# EAGLE design page1 (EAGLE 6.4)
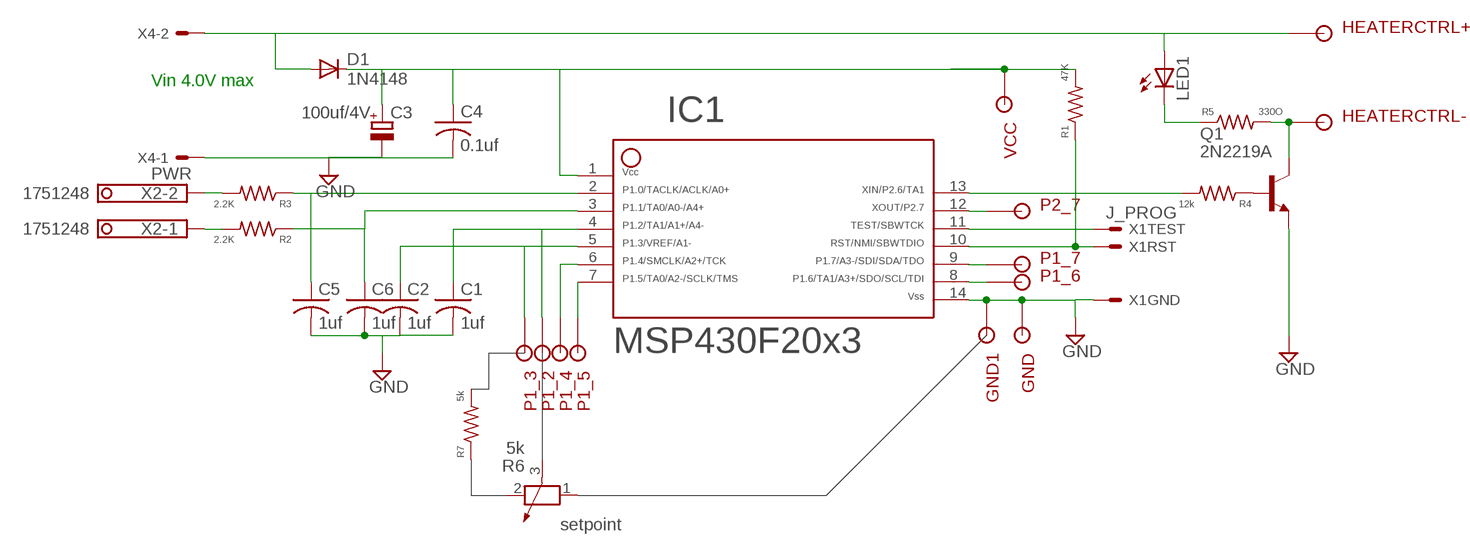
[diagram p0: schematic, sheet 1]

## Parts
C1  1uf  C-USC0805  [C0805]
C2  1uf  C-USC0805  [C0805]
C3  100uf/4V  CPOL-EUSMCB  [SMC_B]
C4  0.1uf  C-USC0805  [C0805]
C5  1uf  C-USC0805  [C0805]
C6  1uf  C-USC0805  [C0805]
D1  1N4148  [DIO-35-10]
GND  SOLDER_POINTA  [P1-13]
GND1  SOLDER_POINTA  [P1-13]
HEATERCTRL+  SOLDER_POINTA  [P1-13]
HEATERCTRL-  SOLDER_POINTA  [P1-13]
IC1  F20X3---N14  [N14]
LED1  LED5MM  [LED5MM]
P1_2  SOLDER_POINTA  [P1-13]
P1_3  SOLDER_POINTA  [P1-13]
P1_4  SOLDER_POINTA  [P1-13]
P1_5  SOLDER_POINTA  [P1-13]
P1_6  SOLDER_POINTA  [P1-13]
P1_7  SOLDER_POINTA  [P1-13]
P2_7  SOLDER_POINTA  [P1-13]
Q1  2N2219A  2N2219ATO92_EBC  [TO92-EBC]
R1  47K  R-US_M0805  [M0805]
R2  2.2K  R-US_M0805  [M0805]
R3  2.2K  R-US_M0805  [M0805]
R4  12k  R-US_M0805  [M0805]
R5  330O  R-US_0207/15  [0207/15]
R6  5k  POTENTIOMETER_PT-10  [PT-10]
R7  5k  R-US_0207/15  [0207/15]
VCC  SOLDER_POINTA  [P1-13]
X1  J_PROG  J_PROG_MSP430  [MOLEX-3PIN]
X2  1751248  [1751248]
X4  PWR  22-23-2021  [22-23-2021]

## Nets
GND: C1.2 C2.2 C3.- C4.2 C5.2 C6.2 GND1.1 GND.1 IC1.14 Q1.E X1.3 X4.1
N$1: IC1.10 R1.1 X1.2
N$2: IC1.11 X1.1
N$3: C3.+ C4.1 D1.P$1(C) IC1.1 R1.2 VCC.1
N$4: R2.2 X2.1
N$5: R3.2 X2.2
N$6: Q1.B R4.1
N$7: C2.1 IC1.5 P1_3.1
N$8: D1.P$2(A) HEATERCTRL+.1 LED1.A X4.2
N$9: C1.1 IC1.4 P1_2.1
N$10: IC1.13 R4.2
N$11: HEATERCTRL-.1 Q1.C R5.2
N$12: LED1.K(C) R5.1
N$13: IC1.6 P1_4.1
N$14: IC1.7 P1_5.1
N$15: C5.1 IC1.2 R3.1
N$16: C6.1 IC1.3 R2.1
N$17: IC1.12 P2_7.1
N$18: IC1.9 P1_7.1
N$19: IC1.8 P1_6.1
Unconnected: R6.1 R6.2 R6.3 R7.1 R7.2

## Notes on the sheet
- Vin 4.0V max
- setpoint

## Library data of the parts
C1 C2 C4-C6 = rcl:C-US: CAPACITOR, American symbol
C3 = rcl:CPOL-EU: POLARIZED CAPACITOR, European symbol
D1 = dedenbear:1N4148
GND GND1 HEATERCTRL+ HEATERCTRL- P1_2-P1_7 P2_7 VCC = Stofer:SOLDER_POINT
IC1 = TI_MSP430_v12:F20X3---N14: ***MSP430F20x3***N14
LED1 = led:LED: LED OSRAM: - CHIPLED LG R971, LG N971, LY N971, LG Q971, LY Q971, LO R971, LY R971 LH N974, LH R974 LS Q976, LO Q976, LY Q976 LO Q996 - Hyper CHIPLED LW Q18S LB Q993, LB Q99A, LB R99A - SideLED LS A670, LO A670, LY A670, LG A670, LP A670 LB A673, LV A673, LT A673, LW A673 LH A674 LY A675 LS A676, LA A676, LO A676, LY A676, LW A676 LS A679, LY A679, LG A679 - Hyper Micro SIDELED® LS Y876, LA Y876, LO Y876, LY Y876 LT Y87S - SmartLED LW L88C, LW L88S LB L89C, LB L89S, LG L890 LS L89K, LO L89K, LY L89K LS L896, LA L896, LO L896, LY L896 - TOPLED LS T670, LO T670, LY T670, LG T670, LP T670 LSG T670, LSP T670, LSY T670, LOP T670, LYG T670 LG T671, LOG T671, LSG T671 LB T673, LV T673, LT T673, LW T673 LH T674 LS T676, LA T676, LO T676, LY T676, LB T676, LH T676, LSB T676, LW T676 LB T67C, LV T67C, LT T67C, LS T67K, LO T67K, LY T67K, LW E67C LS E67B, LA E67B, LO E67B, LY E67B, LB E67C, LV E67C, LT E67C LW T67C LS T679, LY T679, LG T679 LS T770, LO T770, LY T770, LG T770, LP T770 LB T773, LV T773, LT T773, LW T773 LH T774 LS E675, LA E675, LY E675, LS T675 LS T776, LA T776, LO T776, LY T776, LB T776 LHGB T686 LT T68C, LB T68C - Hyper Mini TOPLED® LB M676 - Mini TOPLED Santana® LG M470 LS M47K, LO M47K, LY M47K Source: http://www.osram.convergy.de - LUMILED® LXK2-PW12-R00, LXK2-PW12-S00, LXK2-PW14-U00, LXK2-PW14-V00 LXK2-PM12-R00, LXK2-PM12-S00, LXK2-PM14-U00 LXK2-PE12-Q00, LXK2-PE12-R00, LXK2-PE12-S00, LXK2-PE14-T00, LXK2-PE14-U00 LXK2-PB12-K00, LXK2-PB12-L00, LXK2-PB12-M00, LXK2-PB14-N00, LXK2-PB14-P00, LXK2-PB14-Q00 LXK2-PR12-L00, LXK2-PR12-M00, LXK2-PR14-Q00, LXK2-PR14-R00 LXK2-PD12-Q00, LXK2-PD12-R00, LXK2-PD12-S00 LXK2-PH12-R00, LXK2-PH12-S00 LXK2-PL12-P00, LXK2-PL12-Q00, LXK2-PL12-R00 Source: www.luxeon.com
Q1 = transistor-npn:2N2219A: NPN Transistor
R1-R5 R7 = rcl:R-US_: RESISTOR, American symbol
R6 = rcl:POTENTIOMETER_: Potentiometer
X1 = Stofer:J_PROG_MSP430: .100" (2.54mm) Center Header - 3 Pin
X2 = con-phoenix-350:1751248: MKDS 1/ 2-3,5 Printklemme Nennstrom: 10 A Bemessungsspannung: 160 V Raster: 3,5 mm Polzahl: 2 Montageart: Löten Anschlussart: Schraubanschluss Anschlussrichtung vom Leiter zur Platine: 0° Source: http://eshop.phoenixcontact.com .. 1751248.pdf; OC_FARNELL: unknown; OC_NEWARK: unknown
X4 = con-molex:22-23-2021: .100" (2.54mm) Center Header - 2 Pin

## Board
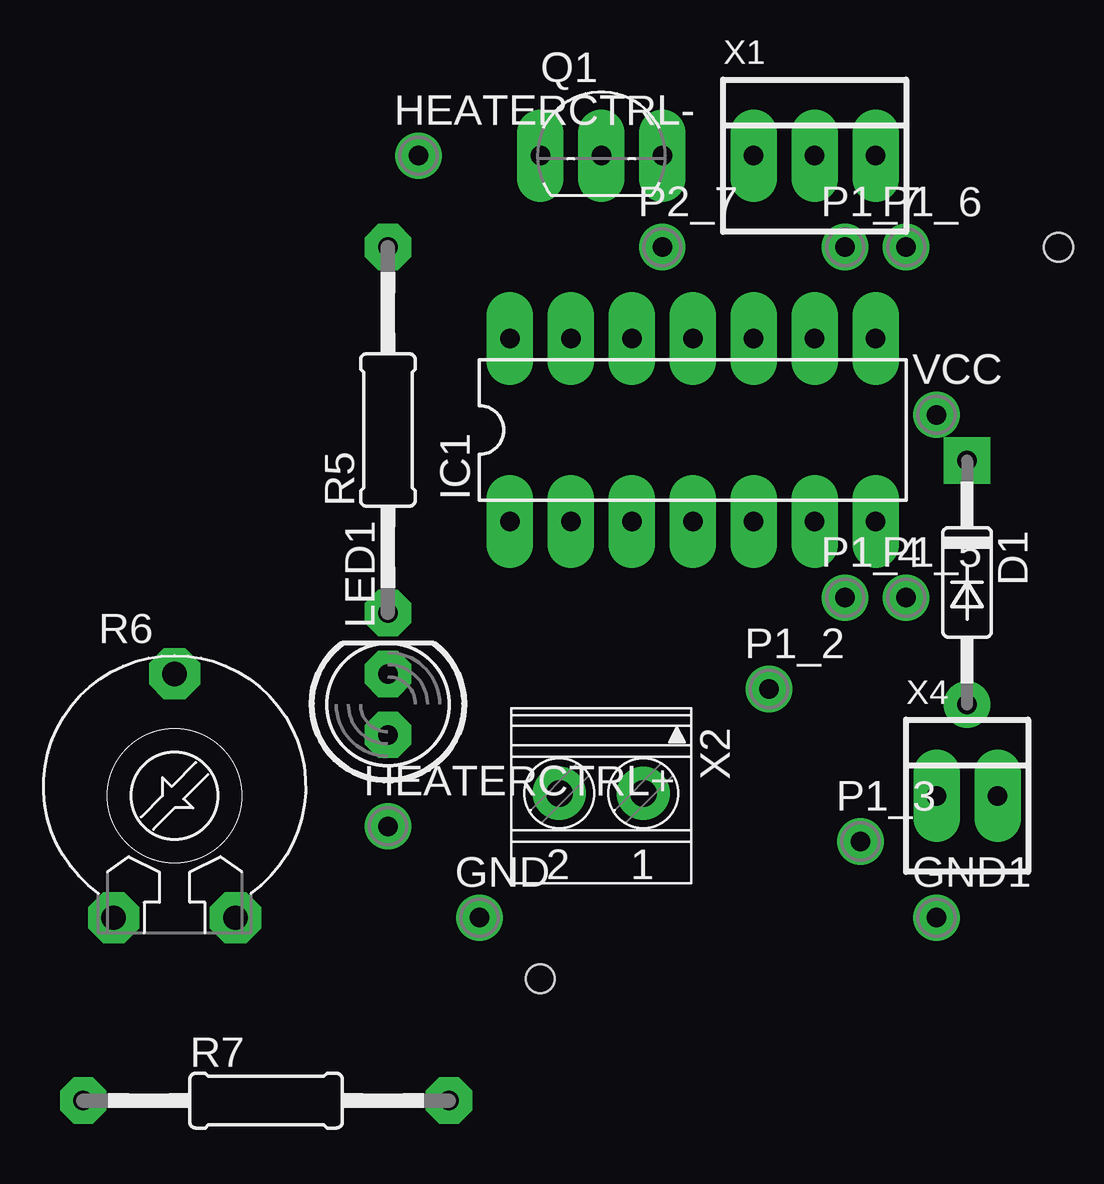
[diagram p1: board, top side]
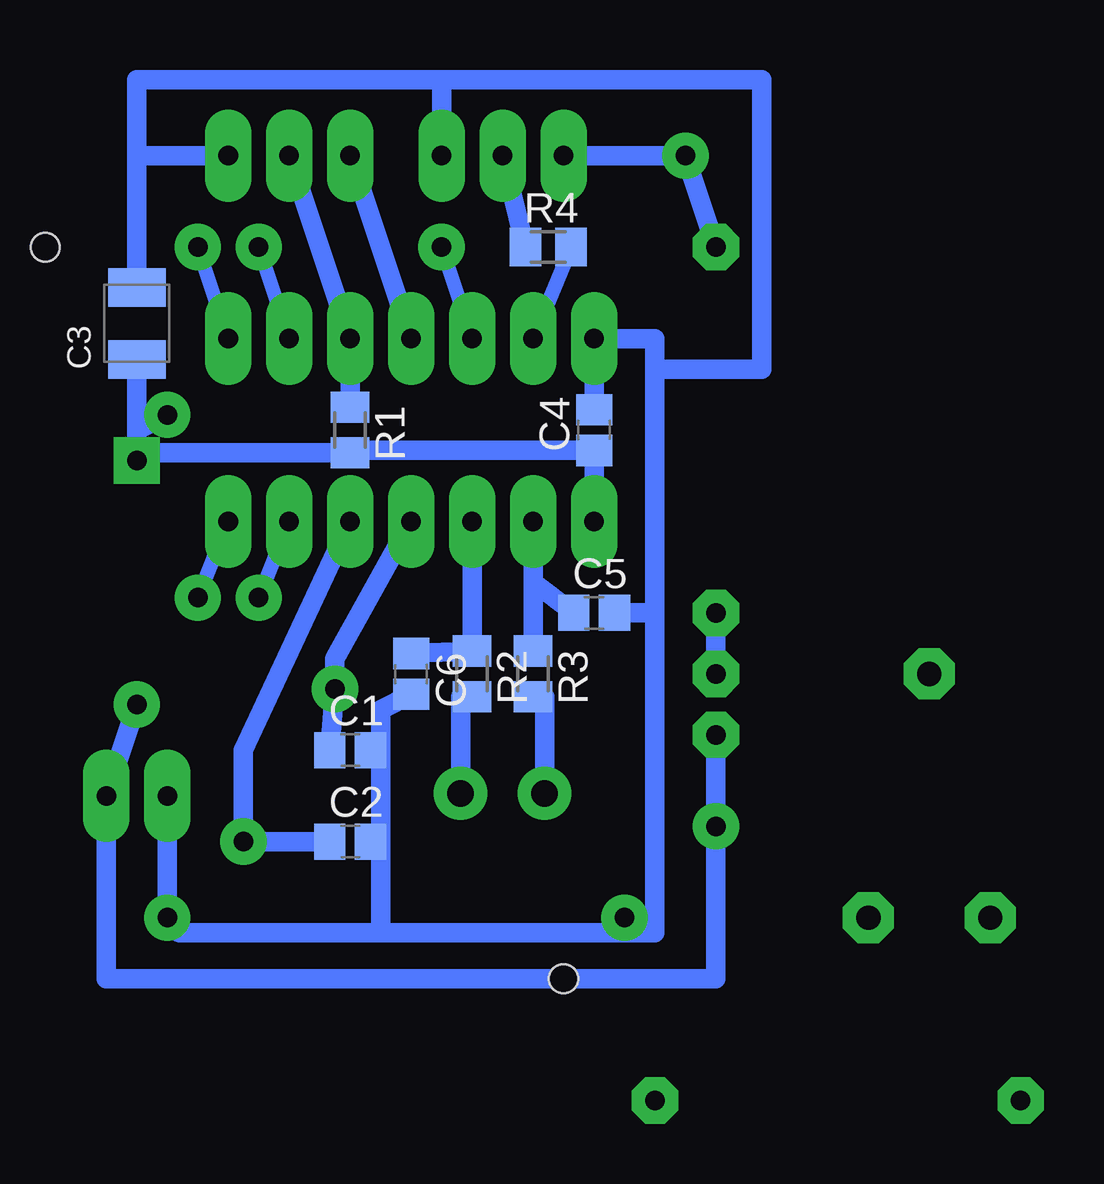
[diagram p2: board, bottom side, seen from below]

No outline drawn. Coordinates in mm, seen from the top.
Copper layers (1*16): Top 0.035mm / dielectric 0.2mm / Bottom 0.035mm
Design rules "default *": minimum track width 10mil, minimum drill 24mil, track to track 8mil, track to pad 8mil, pad to pad 8mil, via to via 8mil, smd to smd 8mil, copper to edge 40mil, drill to drill 8mil, minimum pad ring 15mil, minimum via ring 8mil, stop-mask expansion 4mil, vias tented up to drill 0mil, thermal gap 10mil
Holes 1.2 mm at 34.29,31.75 12.7,1.27

### Footprints (pad centres in the part's own frame; a part is rotated, then mirrored left to right if it is on the bottom)
C0805 = smd 1.3 x 1.5: 1 -0.85,0; 2 0.85,0
SMC_B = smd 1.6 x 2.4: + -1.5,0; - 1.5,0
DIO-35-10 = drill 0.813 square: P$1 -5.08,0 | drill 0.813: P$2 5.08,0
P1-13 = drill 0.813: 1 0,0
N14 = drill 0.813 long: 1 -8.89,-3.81; 2 -6.35,-3.81; 3 -3.81,-3.81; 4 -1.27,-3.81; 5 1.27,-3.81; 6 3.81,-3.81; 7 6.35,-3.81; 8 6.35,3.81; 9 3.81,3.81; 10 1.27,3.81; 11 -1.27,3.81; 12 -3.81,3.81; 13 -6.35,3.81; 14 -8.89,3.81
LED5MM = drill 0.813 pad 1.778 octagon: A -1.27,0; K 1.27,0
TO92-EBC = drill 0.813 long: B 0,-1.27; C -2.54,-1.27; E 2.54,-1.27
M0805 = smd 1.3 x 1.6: 1 -0.95,0; 2 0.95,0
0207/15 = drill 0.813 octagon: 1 -7.62,0; 2 7.62,0
PT-10 = drill 1.016 pad 1.778 octagon: 1 -2.54,-5.08; 2 2.54,-5.08; 3 0,5.08
MOLEX-3PIN = drill 0.813 long: 1 -2.54,0; 2 0,0; 3 2.54,0
1751248 = drill 1.1 pad 1.7: 1 -1.75,-0.1; 2 1.75,-0.1
22-23-2021 = drill 0.813 long: 1 -1.27,0; 2 1.27,0

### Placement (x,y rotation side)
C1  21.59,10.79 0 bottom
C2  21.59,6.99 0 bottom
C3  30.48,28.57 90 bottom
C4  11.43,24.13 90 bottom
C5  11.43,16.51 0 bottom
C6  19.05,13.97 270 bottom
D1  30.48,17.78 270 top
GND  10.16,3.81 0 top
GND1  29.21,3.81 0 top
HEATERCTRL+  6.35,7.62 0 top
HEATERCTRL-  7.62,35.56 0 top
IC1  20.32,24.13 0 top
LED1  6.35,12.7 90 top
P1_2  22.23,13.34 0 top
P1_3  26.04,6.99 0 top
P1_4  25.4,17.14 0 top
P1_5  27.94,17.14 0 top
P1_6  27.94,31.75 0 top
P1_7  25.4,31.75 0 top
P2_7  17.78,31.75 0 top
Q1  15.24,36.83 0 top
R1  21.59,24.13 270 bottom
R2  16.51,13.97 270 bottom
R3  13.97,13.97 270 bottom
R4  13.34,31.75 0 bottom
R5  6.35,24.13 90 top
R6  -2.54,8.89 0 top
R7  1.27,-3.81 0 top
VCC  29.21,24.77 0 top
X1  24.13,35.56 0 top
X2  15.24,8.89 180 top
X4  30.48,8.89 0 top

### Tracks (layer width: path | path; a pad name or v marks a point on that pad's centre or on a via)
GND
  Bottom 0.813: C4.2 IC1.14 8.89,27.94 8.89,26.67 | 8.89,3.17 20.32,3.17 | 20.32,3.17 28.57,3.17 arc90 GND1.1 X4.1 | 17.78,38.73 30.48,38.73 30.48,35.56 | 17.78,38.73 4.45,38.73 4.45,26.67 8.89,26.67 | 17.78,38.73 Q1.E | 8.89,3.17 8.89,16.51 | 8.89,16.51 8.89,26.67 | C5.2 8.89,16.51 | 8.89,3.17 GND.1 | C6.2 20.32,12.48 20.32,11.21 | 20.32,11.21 20.32,7.41 | 20.32,7.41 20.32,3.17 | C2.2 20.32,7.41 | C1.2 20.32,11.21 | 30.48,35.56 C3.- | X1.3 30.48,35.56
N$1
  Bottom 0.813: R1.1 IC1.10 X1.2
N$2
  Bottom 0.813: IC1.11 X1.1
N$3
  Bottom 0.406: R1.2 21.59,22.86 | 30.16,23.18 30.48,23.18 D1.P$1
  Bottom 0.813: IC1.1 C4.1 21.59,23.28 R1.2 30.16,23.18 | D1.P$1 30.48,24.13 | 30.48,24.13 C3.+ | VCC.1 30.48,24.13
N$4
  Bottom 0.813: R2.2 16.99,13.02 X2.1
N$5
  Bottom 0.813: R3.2 13.49,13.02 X2.2
N$6
  Bottom 0.813: R4.1 Q1.B
N$7
  Bottom 0.813: IC1.5 26.04,10.79 P1_3.1 C2.1
N$8
  Bottom 0.813: LED1.A HEATERCTRL+.1 6.35,1.27 31.75,1.27 X4.2 D1.P$2
N$9
  Bottom 0.813: IC1.4 22.23,14.61 P1_2.1 C1.1
N$10
  Bottom 0.61: IC1.13 R4.2
N$11
  Bottom 0.813: Q1.C HEATERCTRL-.1 R5.2
N$12
  Bottom 0.813: LED1.K R5.1
N$13
  Bottom 0.61: P1_4.1 IC1.6
N$14
  Bottom 0.61: P1_5.1 IC1.7
N$15
  Bottom 0.813: IC1.2 13.97,17.78 | C5.1 13.97,17.78 | 13.97,17.78 R3.1
N$16
  Bottom 0.813: IC1.3 R2.1 C6.1
N$17
  Bottom 0.61: IC1.12 P2_7.1
N$18
  Bottom 0.61: IC1.9 P1_7.1
N$19
  Bottom 0.61: IC1.8 P1_6.1